# Altium schematic sheet Analog_System.SchDoc
size A4; Date: 27.05.2014; Author: AOM1; DrawnBy: AOM1; Organization: BFH; Address1: Berner Fachhochschule; Address2: Technik und Informatik; Address3: Jlcoweg 1; Address4: 3400 Burgdorf; DocumentNumber: 1; Revision: 1.0; SheetNumber: 4; SheetTotal: 6; CurrentDate: 27.05.2014
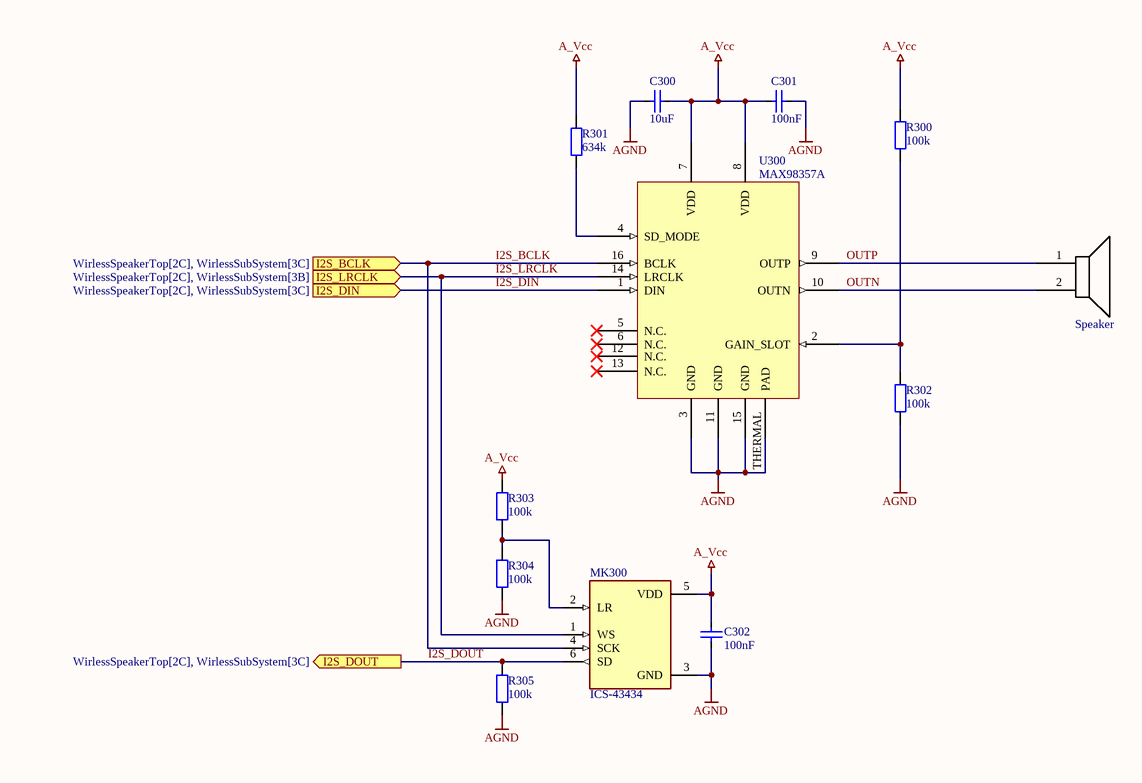
[diagram p0: Analog_System.SchDoc]

## Parts
C300  10uF  [C-0603]
C301  100nF  [C-0603]
C302  100nF  [C-0603]
MK300  ICS-43434  [MK-ICS-43434]
R300  100k  [R-0603]
R301  634k  [R-0603]
R302  100k  [R-0603]
R303  100k  [R-0603]
R304  100k  [R-0603]
R305  100k  [R-0603]
Speaker  Speaker  [A-Speaker-Connector]  (value not drawn)
U300  MAX98357A  [QFN16-3MM]

## Ports
I2S_BCLK (in, see WirlessSpeakerTop[2C], WirlessSubSystem[3C]), I2S_DIN (in, see WirlessSpeakerTop[2C], WirlessSubSystem[3C]), I2S_DOUT (out, see WirlessSpeakerTop[2C], WirlessSubSystem[3C]), I2S_LRCLK (in, see WirlessSpeakerTop[2C], WirlessSubSystem[3B])

## Nets
A_Vcc: C300.2 C301.1 C302.2 MK300.5(VDD) R300.2 R301.2 R303.2 U300.7(VDD) U300.8(VDD)
AGND: C300.1 C301.2 C302.1 MK300.3(GND) R302.1 R304.1 R305.1 U300.3(GND) U300.11(GND) U300.15(GND) U300.THERMAL(PAD)
I2S_BCLK: MK300.4(SCK) U300.16(BCLK) ; port I2S_BCLK
I2S_DIN: U300.1(DIN) ; port I2S_DIN
I2S_DOUT: MK300.6(SD) R305.2 ; port I2S_DOUT
I2S_LRCLK: MK300.1(WS) U300.14(LRCLK) ; port I2S_LRCLK
OUTN: Speaker.2 U300.10(OUTN)
OUTP: Speaker.1 U300.9(OUTP)
NetMK300_2: MK300.2(LR) R303.1 R304.2
NetR300_1: R300.1 R302.2 U300.2(GAIN_SLOT)
NetR301_1: R301.1 U300.4(SD_MODE)

Not connected (* = marked no-connect by the designer): U300 5(N.C.)* 6(N.C.)* 12(N.C.)* 13(N.C.)*

## Notes on the sheet
- Project Name:
- Title:
- Sheet Size:
- Sheet:
- of
- A4
- Drawn by:
- Time:
- Revision:
- Date:
- File Path:

## Library data of the parts
C300-C302 = C-SMD-0603: Multilayer Ceramic Capacitors MLCC; Manufacturer: Murata Electronics; Mfr. Part No.: GRM18...; Order-Code: 81-GRM18...; Price (CHF): 0.12; Distributor: Mouser; Added: 28.08.2018; ComponentLink1Description: Chip Multilayer Ceramic Capacitors; ComponentLink1URL: https://www.mouser.ch/datasheet/2/281/murata_03052018_GRM_Series_1-1310166.pdf; Notice: -; Mounting Style: SMD/SMT; Package: 0603
MK300 = MK-ICS-43434: Microphone MEMS / 60Hz ~ 20kHz Digital, I²S; Manufacturer: TDK InvenSense; Pckage: SMD/SMT; Order-Code: 410-ICS-43434; Added: 16.09.2020; Distributor: Mouser; Price (CHF): 2.64; Mfr. Part No.: ICS-43434; Mounting Style: SMD/SMT; Notice: -
R300-R305 = R-SMD-0603: Thin Film Resistors - SMD  0.1W  1%; Mfr. Part No.: MCU08050C*; Manufacturer: Vishay / Beyschlag; Order-Code: BFH-Lager; Price (CHF): 0.1; Distributor: Mouser; Notice: -; Added: 10.11.2012; Mounting Style: SMD/SMT; Package: 0603
Speaker = A_Speaker: Speaker, 3W 8 Ohm; Manufacturer: *; Provider: *; Order_Number: *; Price: *; Value: *
U300 = U-MAX98357A: Tiny, Low-Cost, PCM Class D Amplifier; Manufacturer: Maxim Integrated; Part-Number: MAX98357AETE+T; Order-Code: 700-MAX98357AETE+T; Added: 28.08.2018; Distributor: Mouser; Price (CHF): 2.03; ComponentLink1Description: Low-Cost, PCM Class D Amplifier; ComponentLink1URL: https://www.mouser.ch/datasheet/2/256/MAX98357A-MAX98357B-271244.pdf; Notice: -; Package: QFN16; Mounting Style: SMD/SMT; Mfr. Part No.: MAX98357AETE+T